# EAGLE design STM32F030F4P6 (EAGLE 9.4.2)
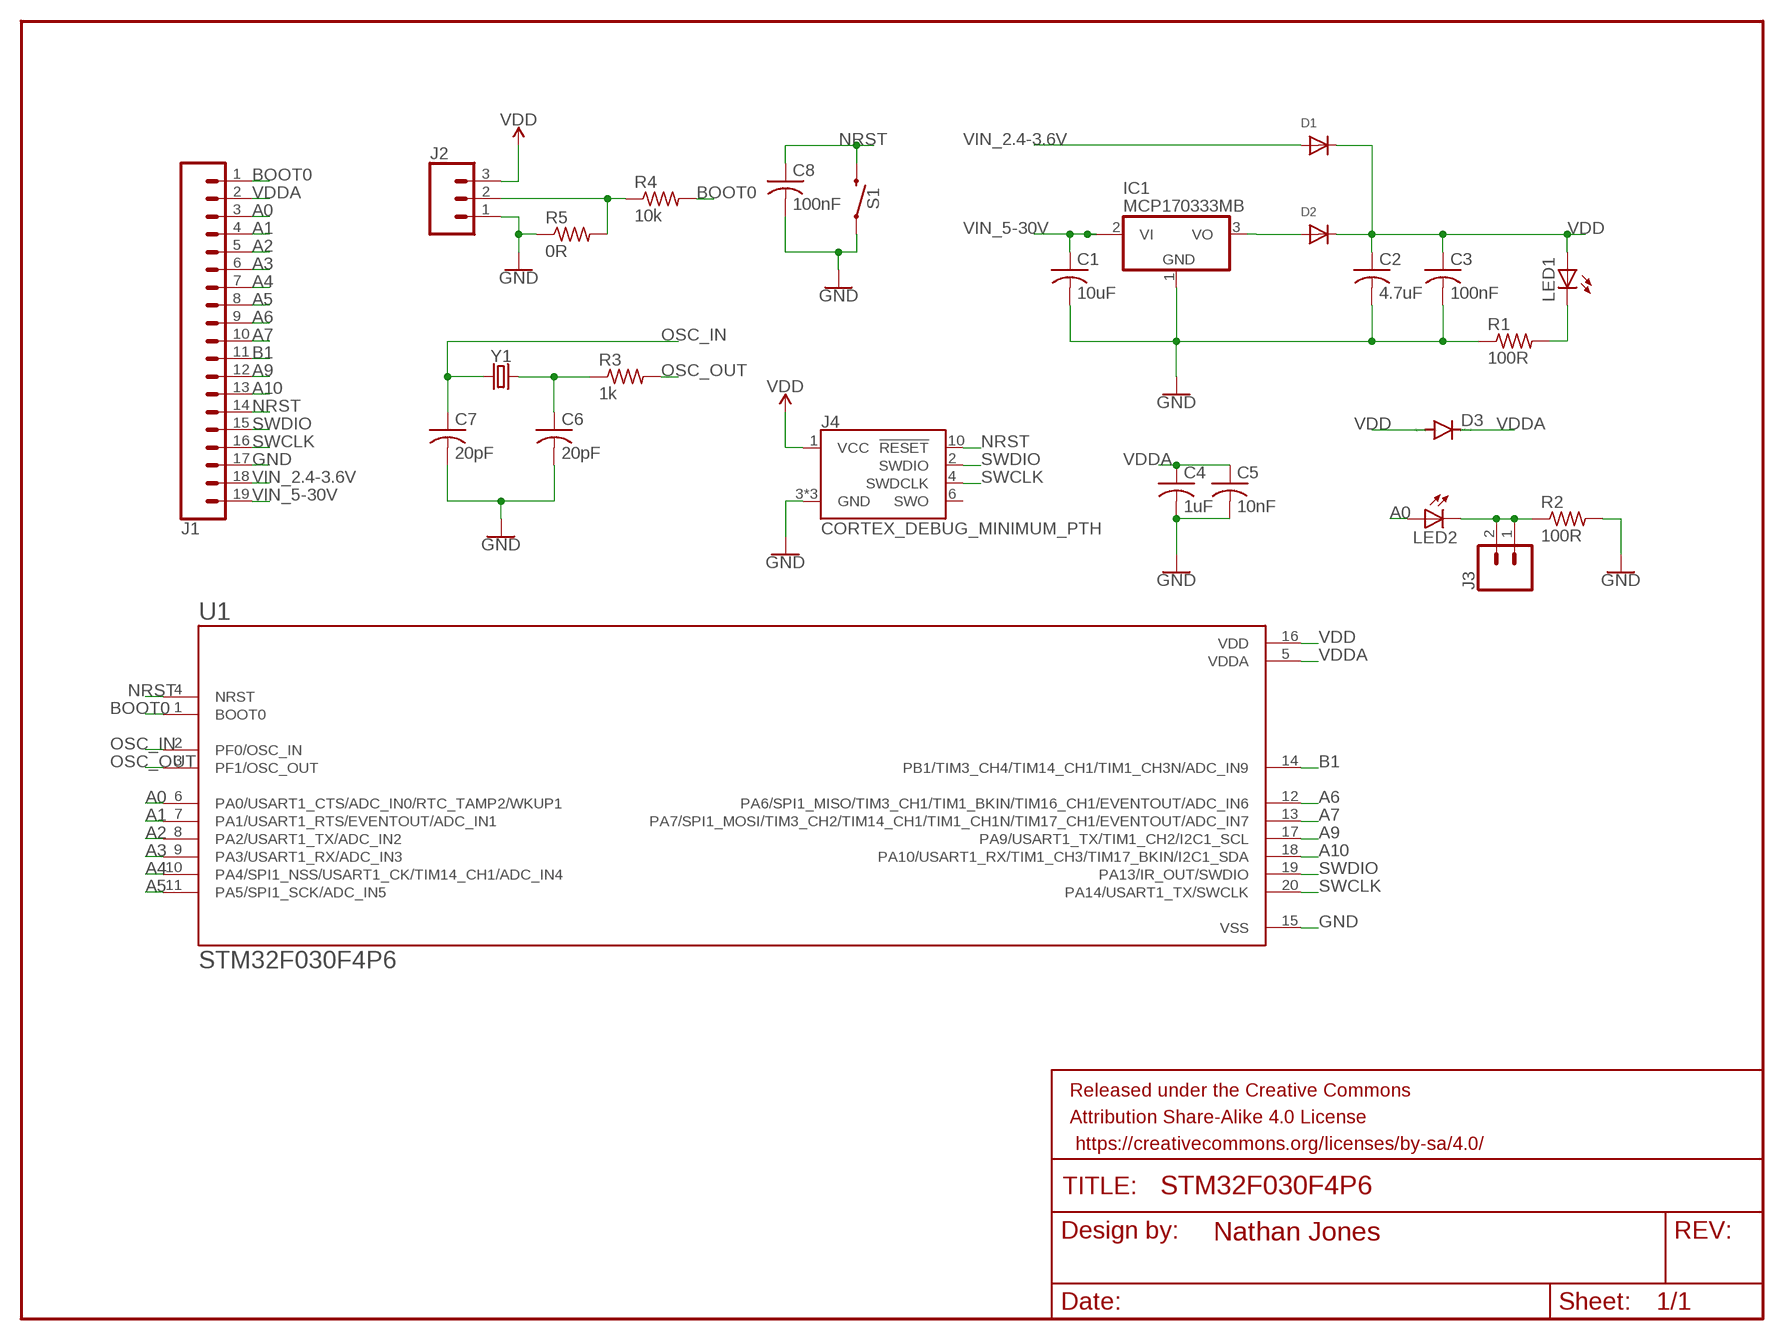
[diagram p0: schematic, sheet 1]

## Parts
C1  10uF  C-USC0603  [C0603]
C2  4.7uF  C-USC0603  [C0603]
C3  100nF  C-USC0603  [C0603]
C4  1uF  C-USC0603  [C0603]
C5  10nF  C-USC0603  [C0603]
C6  20pF  C-USC0603  [C0603]
C7  20pF  C-USC0603  [C0603]
C8  100nF  C-USC0603  [C0603]
D1  DIODESOD-123  [SOD-123]
D2  DIODESOD-123  [SOD-123]
D3  DIODE-DO-214AC  [DO-214AC]
FRAME2  FRAME-LETTERNO_PACKAGE  [DUMMY]
IC1  MCP170333MB  [SOT89]
J1  CONN_19  [1X19]
J2  455-1750-1-ND  CONN_03  [1X03]
J3  CONN_02  [1X02]
J4  CORTEX_DEBUG_MINIMUM_PTH  [2X5-PTH-1.27MM]
LED1  LEDCHIPLED_0603  [CHIPLED_0603]
LED2  LEDCHIPLED_0603  [CHIPLED_0603]
R1  100R  R-US_R0603  [R0603]
R2  100R  R-US_R0603  [R0603]
R3  1k  R-US_R0603  [R0603]
R4  10k  R-US_R0603  [R0603]
R5  0R  R-US_R0603  [R0603]
S1  MOMENTARY-SWITCH-SPST-SMD-5.2-REDUNDANT  [TACTILE_SWITCH_SMD_5.2MM]
U1  STM32F030F4P6  [SOP65P640X120-20N]
Y1  CRYSTALSMD-5X3.2-2PAD  [CRYSTAL-SMD-5X3.2-2PAD]

## Nets
A0: J1.3 LED2.A U1.6(PA0/USART1_CTS/ADC_IN0/RTC_TAMP2/WKUP1)
A1: J1.4 U1.7(PA1/USART1_RTS/EVENTOUT/ADC_IN1)
A2: J1.5 U1.8(PA2/USART1_TX/ADC_IN2)
A3: J1.6 U1.9(PA3/USART1_RX/ADC_IN3)
A4: J1.7 U1.10(PA4/SPI1_NSS/USART1_CK/TIM14_CH1/ADC_IN4)
A5: J1.8 U1.11(PA5/SPI1_SCK/ADC_IN5)
A6: J1.9 U1.12(PA6/SPI1_MISO/TIM3_CH1/TIM1_BKIN/TIM16_CH1/EVENTOUT/ADC_IN6)
A7: J1.10 U1.13(PA7/SPI1_MOSI/TIM3_CH2/TIM14_CH1/TIM1_CH1N/TIM17_CH1/EVENTOUT/ADC_IN7)
A9: J1.12 U1.17(PA9/USART1_TX/TIM1_CH2/I2C1_SCL)
A10: J1.13 U1.18(PA10/USART1_RX/TIM1_CH3/TIM17_BKIN/I2C1_SDA)
B1: J1.11 U1.14(PB1/TIM3_CH4/TIM14_CH1/TIM1_CH3N/ADC_IN9)
BOOT0: J1.1 R4.2 U1.1(BOOT0)
GND: C1.2 C2.2 C3.2 C4.2 C5.2 C6.2 C7.2 C8.2 IC1.1(GND) J1.17 J2.1 J4.3(GND) J4.5(GND) J4.9(GND) R1.1 R2.2 R5.1 S1.1 S1.2 U1.15(VSS)
N$1: J2.2 R4.1 R5.2
N$2: J3.1 J3.2 LED2.C R2.1
N$3: C6.1 R3.1 Y1.P$1
N$5: D2.A IC1.3(VO)
N$7: LED1.C R1.2
NRST: C8.1 J1.14 J4.10(!RESET) S1.3 S1.4 U1.4(NRST)
OSC_IN: C7.1 U1.2(PF0/OSC_IN) Y1.P$2
OSC_OUT: R3.2 U1.3(PF1/OSC_OUT)
SWCLK: J1.16 J4.4(SWDCLK) U1.20(PA14/USART1_TX/SWCLK)
SWDIO: J1.15 J4.2(SWDIO) U1.19(PA13/IR_OUT/SWDIO)
VDD: C2.1 C3.1 D1.C D2.C D3.A J2.3 J4.1(VCC) LED1.A U1.16(VDD)
VDDA: C4.1 C5.1 D3.C J1.2 U1.5(VDDA)
VIN_2.4-3.6V: D1.A J1.18
VIN_5-30V: C1.1 IC1.2@1(VI1) J1.19
Unconnected: IC1.2(VI) J4.6(SWO)

## Library data of the parts
C1-C8 = adafruit:C-US: CAPACITOR, American symbol
D1 D2 = adafruit:DIODE: Diode SMADIODE - SMA Surface Mount Package 20V 1A Schottky Diode Digikey: 641-1014-6-ND DO-1N4148 - Through Hole Small Current Diode SOD-123 20V 1 A (.5mV Vf) Schottky Diode - Digikey: MBRX120TPMSCT-ND SOD-323 10V 570mA (.38mV Vf, 3ns) Schottky Diode - Digikey: ZLLS410CT-ND SOD-523 30V 30mA Schottky Diode (RB751S-40TE61) - Digikey: RB751S-40TE61CT-ND SOT23-R/W - SOT23 Package (R = Solder Paste/Reflow Ovens, W = Hand-Soldering) BAT54Film 40V 300mA - Digikey: 497-7162-1-ND
D3 = diode:DIODE-: DIODE
FRAME2 = SparkFun-Aesthetics:FRAME-LETTER: Schematic Frame - Letter Standard 8.5x11 US Letter frame; DESIGNER: Nathan Jones; VERSION: v01
IC1 = linear:MCP1703*: 250 mA, 16V, Low Quiescent Current LDO Regulator Source: http://ww1.microchip.com/downloads/en/DeviceDoc/22049b.pdf
J1 = SparkFun-Connectors:CONN_19: Multi connection point. Often used as Generic Header-pin footprint for 0.1 inch spaced/style header connections On any of the 0.1 inch spaced packages, you can populate with these: Break Away Headers - Straight <https://www.sparkfun.com/products/116> (PRT-00116) Break Away Male Headers - Right Angle <https://www.sparkfun.com/products/553> (PRT-00553) Female Headers <https://www.sparkfun.com/products/115> (PRT-00115) Break Away Headers - Machine Pin <https://www.sparkfun.com/products/117> (PRT-00117) Break Away Female Headers - Swiss Machine Pin <https://www.sparkfun.com/products/743> (PRT-00743) For SCREWTERMINALS and SPRING TERMINALS visit here: Screw Terimnals on SparkFun.com <https://www.sparkfun.com/search/results?term=Screw+Terminals> (5mm/3.5mm/2.54mm spacing) This device is also useful as a general connection point to wire up your design to another part of your project. Our various solder wires solder well into these plated through hole pads. Hook-Up Wire - Assortment (Stranded, 22 AWG) <https://www.sparkfun.com/products/11375> (PRT-11375) Hook-Up Wire - Assortment (Solid Core, 22 AWG) <https://www.sparkfun.com/products/11367> (PRT-11367) View the entire wire category on our website here <https://www.sparkfun.com/categories/141> Special notes: Molex polarized connector foot print use with SKU : PRT-08231 with associated crimp pins and housings. 1MM SMD Version SKU: PRT-10208 NOTES ON THE VARIANTS LOCK and LOCK_LONGPADS... This footprint was designed to help hold the alignment of a through-hole component (i.e. 6-pin header) while soldering it into place. You may notice that each hole has been shifted either up or down by 0.005 of an inch from it's more standard position (which is a perfectly straight line). This slight alteration caused the pins (the squares in the middle) to touch the edges of the holes. Because they are alternating, it causes a "brace" to hold the component in place. 0.005 has proven to be the perfect amount of "off-center" position when using our standard breakaway headers. Although looks a little odd when you look at the bare footprint, once you have a header in there, the alteration is very hard to notice. Also,if you push a header all the way into place, it is covered up entirely on the bottom side.
J2 = SparkFun-Connectors:CONN_03: Multi connection point. Often used as Generic Header-pin footprint for 0.1 inch spaced/style header connections On any of the 0.1 inch spaced packages, you can populate with these: Break Away Headers - Straight <https://www.sparkfun.com/products/116> (PRT-00116) Break Away Male Headers - Right Angle <https://www.sparkfun.com/products/553> (PRT-00553) Female Headers <https://www.sparkfun.com/products/115> (PRT-00115) Break Away Headers - Machine Pin <https://www.sparkfun.com/products/117> (PRT-00117) Break Away Female Headers - Swiss Machine Pin <https://www.sparkfun.com/products/743> (PRT-00743) Stackable Header - 3 Pin (Female, 0.1") <https://www.sparkfun.com/products/13875> (PRT-13875) For SCREWTERMINALS and SPRING TERMINALS visit here: Screw Terimnals on SparkFun.com <https://www.sparkfun.com/search/results?term=Screw+Terminals> (5mm/3.5mm/2.54mm spacing) This device is also useful as a general connection point to wire up your design to another part of your project. Our various solder wires solder well into these plated through hole pads. Hook-Up Wire - Assortment (Stranded, 22 AWG) <https://www.sparkfun.com/products/11375> (PRT-11375) Hook-Up Wire - Assortment (Solid Core, 22 AWG) <https://www.sparkfun.com/products/11367> (PRT-11367) View the entire wire category on our website here <https://www.sparkfun.com/categories/141> Special notes: Molex polarized connector foot print use with SKU : PRT-08232 with associated crimp pins and housings.; PROD_ID: XXX-00000
J3 = SparkFun-Connectors:CONN_02: Multi connection point. Often used as Generic Header-pin footprint for 0.1 inch spaced/style header connections On any of the 0.1 inch spaced packages, you can populate with these: Break Away Headers - Straight <https://www.sparkfun.com/products/116> (PRT-00116) Break Away Male Headers - Right Angle <https://www.sparkfun.com/products/553> (PRT-00553) Female Headers <https://www.sparkfun.com/products/115> (PRT-00115) Break Away Headers - Machine Pin <https://www.sparkfun.com/products/117> (PRT-00117) Break Away Female Headers - Swiss Machine Pin <https://www.sparkfun.com/products/743> (PRT-00743) For SCREWTERMINALS and SPRING TERMINALS visit here: Screw Terimnals on SparkFun.com <https://www.sparkfun.com/search/results?term=Screw+Terminals> (5mm/3.5mm/2.54mm spacing) This device is also useful as a general connection point to wire up your design to another part of your project. Our various solder wires solder well into these plated through hole pads. Hook-Up Wire - Assortment (Stranded, 22 AWG) <https://www.sparkfun.com/products/11375> (PRT-11375) Hook-Up Wire - Assortment (Solid Core, 22 AWG) <https://www.sparkfun.com/products/11367> (PRT-11367) View the entire wire category on our website here <https://www.sparkfun.com/categories/141> Special notes: Molex polarized connector foot print use with: PRT-08233 with associated crimp pins and housings. 2.54_SCREWTERM for use with PRT-10571. 3.5mm Screw Terminal footprints for PRT-08084 5mm Screw Terminal footprints for use with PRT-08432
J4 = SparkFun-Connectors:CORTEX_DEBUG_MINIMUM: Cortex Debug Connector - 10 pin Supports JTAG debug, Serial Wire debug, and Serial Wire Viewer. PTH and SMD connector options available. General Connector Information <http://infocenter.arm.com/help/topic/com.arm.doc.faqs/attached/13634/cortex_debug_connectors.pdf> Products: PTH Connector <http://www.digikey.com/product-detail/en/cnc-tech/3220-10-0100-00/1175-1627-ND/3883661> -via Digi-Key SparkFun PSoc <https://www.sparkfun.com/products/13229> SparkFun T <https://www.sparkfun.com/products/13810>
LED1 LED2 = adafruit:LED: LED OSRAM: - CHIPLED LG R971, LG N971, LY N971, LG Q971, LY Q971, LO R971, LY R971 LH N974, LH R974 LS Q976, LO Q976, LY Q976 LO Q996 - Hyper CHIPLED LW Q18S LB Q993, LB Q99A, LB R99A - SideLED LS A670, LO A670, LY A670, LG A670, LP A670 LB A673, LV A673, LT A673, LW A673 LH A674 LY A675 LS A676, LA A676, LO A676, LY A676, LW A676 LS A679, LY A679, LG A679 - Hyper Micro SIDELED® LS Y876, LA Y876, LO Y876, LY Y876 LT Y87S - SmartLED LW L88C, LW L88S LB L89C, LB L89S, LG L890 LS L89K, LO L89K, LY L89K LS L896, LA L896, LO L896, LY L896 - TOPLED LS T670, LO T670, LY T670, LG T670, LP T670 LSG T670, LSP T670, LSY T670, LOP T670, LYG T670 LG T671, LOG T671, LSG T671 LB T673, LV T673, LT T673, LW T673 LH T674 LS T676, LA T676, LO T676, LY T676, LB T676, LH T676, LSB T676, LW T676 LB T67C, LV T67C, LT T67C, LS T67K, LO T67K, LY T67K, LW E67C LS E67B, LA E67B, LO E67B, LY E67B, LB E67C, LV E67C, LT E67C LW T67C LS T679, LY T679, LG T679 LS T770, LO T770, LY T770, LG T770, LP T770 LB T773, LV T773, LT T773, LW T773 LH T774 LS E675, LA E675, LY E675, LS T675 LS T776, LA T776, LO T776, LY T776, LB T776 LHGB T686 LT T68C, LB T68C - Hyper Mini TOPLED® LB M676 - Mini TOPLED Santana® LG M470 LS M47K, LO M47K, LY M47K Source: http://www.osram.convergy.de/
R1-R5 = adafruit:R-US_: RESISTOR, American symbol
S1 = SparkFun-Switches:MOMENTARY-SWITCH-SPST: Momentary Switch (Pushbutton) - SPST Normally-open (NO) SPST momentary switches (buttons, pushbuttons). Variants PTH-12MM - 12mm square, through-hole Momentary Pushbutton Switch - 12mm Square <https://www.sparkfun.com/products/9190> (COM-09190) PTH-6.0MM, PTH-6.0MM-KIT - 6.0mm square, through-hole Mini Pushbutton Switch <https://www.sparkfun.com/products/97> (COM-00097) KIT package intended for soldering kit's - only one side of pads' copper is exposed. PTH-RIGHT-ANGLE-KIT - Right-angle, through-hole Right Angle Tactile Button <https://www.sparkfun.com/products/10791> - Used on SparkFun BigTime Watch Kit <https://www.sparkfun.com/products/11734> SMD-12MM - 12mm square, surface-mount Tactile Button - SMD (12mm) <https://www.sparkfun.com/products/12993> (COM-12993) Used on SparkFun PicoBoard <https://www.sparkfun.com/products/11888> SMD-4.5MM - 4.5mm Square Trackball Switch Used on SparkFun Blackberry Trackballer Breakout <https://www.sparkfun.com/products/13169> SMD-4.6MMX2.8MM - 4.60mm x 2.80mm, surface mount Used on SparkFun SAMD21 Mini Breakout <https://www.sparkfun.com/products/13664> SMD-5.2MM, SMD-5.2-REDUNDANT - 5.2mm square, surface-mount Mini Pushbutton Switch - SMD <https://www.sparkfun.com/products/8720> (COM-08720) Used on Arduino Pro Mini <https://www.sparkfun.com/products/11114> REDUNDANT package connects both switch circuits together SMD-6.0X3.5MM - 6.0 x 3.5mm, surface mount Momentary Reset Switch SMD <https://www.sparkfun.com/products/8229> (COM-08229) SMD-6.2MM-TALL - 6.2mm square, surface mount Tactile Button - SMD (6mm) <https://www.sparkfun.com/products/12992> Used on SparkFun Digital Sandbox <https://www.sparkfun.com/products/12651> SMD-RIGHT-ANGLE - Right-angle, surface mount Used on SparkFun Block for Intel® Edison - Arduino <https://www.sparkfun.com/products/13036>; PROD_ID: SWCH-08247; SF_SKU: COM-08720
U1 = STM32F030F4P6:STM32F030F4P6: MCU 32-bit STM32F ARM Cortex M0 RISC 16KB Flash 2.5V/3.3V 20-Pin TSSOP Tray; DESCRIPTION: ARM® Cortex®-M0 STM32F0 Microcontroller IC 32-Bit 48MHz 16KB _16K x 8_ FLASH; DIGI-KEY_PART_NUMBER: 497-14044-5-ND; DIGI-KEY_PURCHASE_URL: https://www.digikey.com/product-detail/en/stmicroelectronics/STM32F030F4P6/497-14044-5-ND/4357517?utm_source=snapeda&utm_medium=aggregator&utm_campaign=symbol; MF: STMicroelectronics; MP: STM32F030F4P6; PACKAGE: TSSOP-20 STMicroelectronics
Y1 = SparkFun-Clocks:CRYSTAL: Crystals (Generic) These are passive quartz crystals, which can be used as a clock source for a microcontroller. Crystal's are two-terminal devices. They require external "load" capacitors to generate an oscillating signal.

## Board
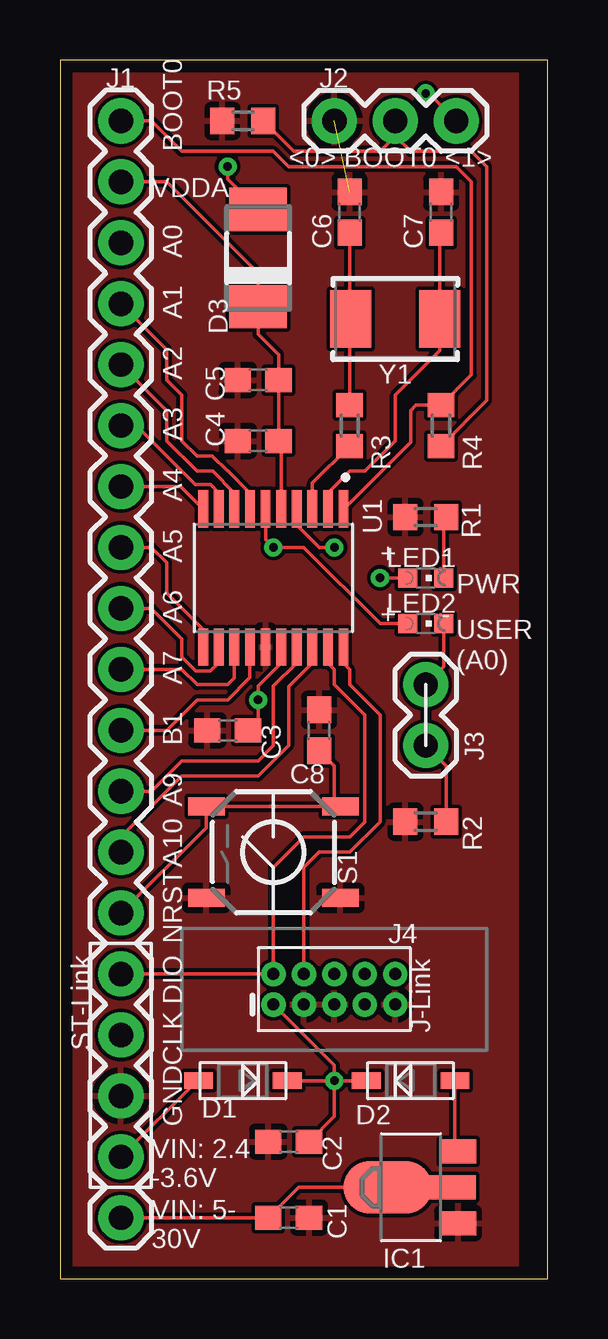
[diagram p1: board, top side]
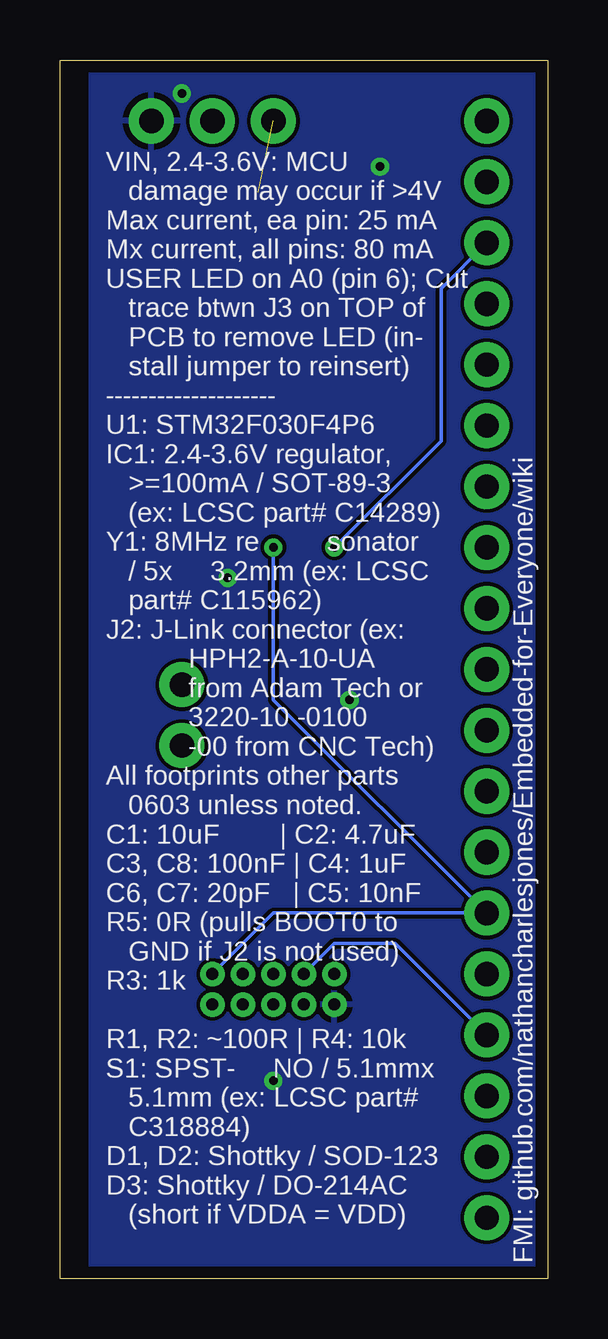
[diagram p2: board, bottom side, seen from below]

Size 20.32 x 50.8 mm. Coordinates in mm from the lower left corner, seen from the top.
Outline: 0,0 20.32,0 20.32,50.8 0,50.8 0,0
Copper layers (1*16): Top 0.035mm / dielectric 1.5mm / Bottom 0.035mm
Design rules "default *": minimum track width 6mil, minimum drill 0.35mm, track to track 6mil, track to pad 6mil, pad to pad 6mil, via to via 6mil, smd to smd 6mil, copper to edge 20mil, drill to drill 6mil, minimum pad ring 10mil, minimum via ring 8mil, stop-mask expansion 4mil, vias tented up to drill 0mil, thermal gap 10mil

### Footprints (pad centres in the part's own frame; a part is rotated, then mirrored left to right if it is on the bottom)
C0603 = smd 1.1 x 1: 1 -0.85,0; 2 0.85,0
SOD-123 = smd 1.2 x 0.7: A 1.85,0; C -1.85,0
DO-214AC = smd 1.8 x 2.4: A 2.025,0; C -2.025,0
SOT89 = smd 1 x 1.5: 1 -1.499,-1.981; 3 1.499,-1.981 | smd 1 x 2: 2 0,-1.727 | smd 2.2 x 3.7: 2@1 0,0.94
1X19 = drill 1.016 pad 1.88: 1 0,0; 2 2.54,0; 3 5.08,0; 4 7.62,0; 5 10.16,0; 6 12.7,0; 7 15.24,0; 8 17.78,0; 9 20.32,0; 10 22.86,0; 11 25.4,0; 12 27.94,0; 13 30.48,0; 14 33.02,0; 15 35.56,0; 16 38.1,0; 17 40.64,0; 18 43.18,0; 19 45.72,0
1X03 = drill 1.016 pad 1.88: 1 0,0; 2 2.54,0; 3 5.08,0
1X02 = drill 1.016 pad 1.88: 1 0,0; 2 2.54,0
2X5-PTH-1.27MM = drill 0.508 pad 1: 1 -2.54,-0.635; 2 -2.54,0.635; 3 -1.27,-0.635; 4 -1.27,0.635; 5 0,-0.635; 6 0,0.635; 7 1.27,-0.635; 8 1.27,0.635; 9 2.54,-0.635; 10 2.54,0.635
CHIPLED_0603 = smd 0.8 x 0.8: A 0,-0.75; C 0,0.75
R0603 = smd 1 x 1.1: 1 -0.85,0; 2 0.85,0
TACTILE_SWITCH_SMD_5.2MM = smd 1.524 x 0.762: 1 -2.794,1.905; 2 2.794,1.905; 3 -2.794,-1.905; 4 2.794,-1.905
SOP65P640X120-20N = smd 1.56 x 0.41: 1 -2.88,2.925; 2 -2.88,2.275; 3 -2.88,1.625; 4 -2.88,0.975; 5 -2.88,0.325; 6 -2.88,-0.325; 7 -2.88,-0.975; 8 -2.88,-1.625; 9 -2.88,-2.275; 10 -2.88,-2.925; 11 2.88,-2.925; 12 2.88,-2.275; 13 2.88,-1.625; 14 2.88,-0.975; 15 2.88,-0.325; 16 2.88,0.325; 17 2.88,0.975; 18 2.88,1.625; 19 2.88,2.275; 20 2.88,2.925
CRYSTAL-SMD-5X3.2-2PAD = smd 1.7 x 2.4: P$1 1.85,0; P$2 -1.85,0

### Placement (x,y rotation side)
C1  9.53,2.54 0 top
C2  9.53,5.71 180 top
C3  6.99,22.86 180 top
C4  8.26,34.92 180 top
C5  8.26,37.47 180 top
C6  12.06,44.45 90 top
C7  15.88,44.45 90 top
C8  10.79,22.86 90 top
D1  7.62,8.26 180 top
D2  14.61,8.26 0 top
D3  8.26,42.55 90 top
FRAME2  -10.79,0 0 top  (outside the outline)
IC1  14.61,3.81 90 top
J1  2.54,48.26 270 top
J2  11.43,48.26 0 top
J3  15.24,22.23 90 top
J4  11.43,12.06 0 top
LED1  15.24,29.21 270 top
LED2  15.24,27.3 270 top
R1  15.24,31.75 0 top
R2  15.24,19.05 180 top
R3  12.06,35.56 270 top
R4  15.88,35.56 90 top
R5  7.62,48.26 0 top
S1  8.89,17.78 180 top
U1  8.89,29.21 270 top
Y1  13.97,40.01 180 top

### Tracks (layer width: path | path; a pad name or v marks a point on that pad's centre or on a via)
A0  (via drill 0.35)
  Top 0.152: U1.6 8.56,30.8 v8.89,30.48 10.16,30.48 13.34,27.3 LED2.A
  Bottom 0.152: v8.89,30.48 4.45,34.92 4.45,41.27 J1.3
A1
  Top 0.152: U1.7 7.92,32.75 7.01,33.66 6.99,33.66 6.35,34.29 5.71,34.29 5.08,34.92 5.08,36.83 4.45,37.47 4.45,38.73 J1.4
A2
  Top 0.152: U1.8 7.26,32.75 6.36,33.66 5.71,33.66 4.45,34.92 4.45,36.2 J1.5
A3
  Top 0.152: U1.9 6.62,32.76 6.27,33.1 5.64,33.1 3.17,35.56 J1.6
A4
  Top 0.152: U1.10 5.04,33.02 J1.7
A5
  Top 0.152: U1.11 5.96,27.05 4.45,28.57 4.45,29.84 3.81,30.48 J1.8
A6
  Top 0.152: U1.12 6.62,25.67 6.26,25.32 5.67,25.32 5.08,25.91 5.08,26.67 3.81,27.94 J1.9
A7
  Top 0.152: U1.13 7.26,25.05 6.99,24.77 5.71,24.77 5.08,25.4 J1.10
A9
  Top 0.152: U1.17 9.87,25.67 8.89,24.7 8.89,22.23 8.26,21.59 5.08,21.59 3.81,20.32 J1.12
A10
  Top 0.152: U1.18 10.52,25.67 9.53,24.68 9.53,22.23 8.26,20.95 5.08,20.95 2.54,18.41 J1.13
B1
  Top 0.152: U1.14 7.92,25.06 6.99,24.13 5.71,24.13 4.45,22.86 J1.11
BOOT0
  Top 0.152: U1.1 14.61,34.88 14.61,36.2 14.82,36.41 R4.2 17.14,37.68 17.14,45.72 16.51,46.35 9.53,46.35 8.89,46.99 5.08,46.99 3.81,48.26 J1.1
GND  (1 unrouted)
  pour Top: 0,50.8 19.05,50.8 19.05,0 0,0
N$1
  Top 0.152: R4.1 17.78,36.62 17.78,46.35 17.14,46.99 14.61,46.99 13.97,47.62 | J2.2 13.97,47.62 | 13.97,47.62 13.34,46.99 9.74,46.99 R5.2
N$2
  Top 0.152: LED2.C 15.99,25.52 J3.2 J3.1 16.09,21.38 R2.1
N$3
  Top 0.152: R3.1 12.06,39.95 Y1.P$1 12.06,40.06 C6.1
N$5
  Top 0.152: IC1.3 16.45,5.44 D2.A
N$7
  Top 0.152: LED1.C 15.99,31.65 R1.2
NRST  (via drill 0.35)
  Top 0.152: J1.14 6.1,18.8 S1.4 11.43,19.68 | 11.43,19.68 S1.3 | C8.1 11.43,21.38 11.43,19.68 | U1.4 9.87,31.41 10.79,30.48 v11.43,30.48
  Bottom 0.152: J4.10 11.43,15.24 8.89,15.24 J1.14 11.43,24.13 v11.43,30.48
OSC_IN
  Top 0.152: U1.2 11.16,32.76 12.06,33.66 12.7,33.66 13.97,34.92 13.97,36.83 15.82,38.68 Y1.P$2 15.82,43.55 C7.1
OSC_OUT
  Top 0.152: U1.3 10.52,33.16 R3.2
SWCLK
  Top 0.152: U1.20 11.81,25.65 12.06,25.4 12.06,24.77 13.34,23.5 13.34,19.05 12.06,17.78 10.79,17.78 10.16,17.14 J4.4
  Bottom 0.152: J1.16 6.35,13.97 8.89,13.97 J4.4
SWDIO
  Top 0.152: U1.19 11.16,25.66 11.43,25.4 11.43,24.77 12.7,23.5 12.7,19.05 12.06,18.41 10.16,18.41 8.89,17.14 J4.2 J1.15
VDD  (via drill 0.35)
  Top 0.152: D3.A 6.99,45.84 v6.99,46.35 | J2.3 15.36,49.41 v15.24,49.41 | U1.16 9.21,25.67 8.26,24.71 v8.26,24.13 8.26,23.28 C3.1 | LED1.A v13.34,29.21 | J4.1 11.43,8.89 v11.43,8.26 | D1.C v11.43,8.26 | v11.43,8.26 D2.C | C2.1 11.43,6.77 v11.43,8.26
  pour Bottom: 0,50.8 19.05,50.8 19.05,0 0,0
VDDA
  Top 0.152: U1.5 9.21,34.81 C4.1 C5.1 9.11,38.52 8.26,39.37 D3.C 8.26,41.91 4.45,45.72 J1.2
VIN_2.4-3.6V
  Top 0.152: J1.18 5.71,8.26 D1.A
VIN_5-30V
  Top 0.152: J1.19 C1.1 9.95,3.81 IC1.2@1

### Text on the board
tPlace: J-Link | ST-Link
tNames: BOOT0 | <0> BOOT0 <1> | VDDA | A0 | A1 | A2 | A3 | A4 | A5 | + - | PWR | A6 | + - | USER | A7 | (A0) | B1 | A9 | A10 | NRST | DIO | CLK | GND | VIN: 2.4 / -3.6V | VIN: 5- / 30V
bNames: VIN, 2.4-3.6V: MCU / damage may occur if >4V / Max current, ea pin: 25 mA / Mx current, all pins: 80 mA / USER LED on A0 (pin 6); Cut / trace btwn J3 on TOP of / PCB to remove LED (in- / stall jumper to reinsert) / -------------------- / U1: STM32F030F4P6 / IC1: 2.4-3.6V regulator, / >=100mA / SOT-89-3 / (ex: LCSC part# C14289) / Y1: 8MHz re sonator / / 5x 3.2mm (ex: LCSC / part# C115962) / J2: J-Link connector (ex: / HPH2-A-10-UA / from Adam Tech or / 3220-10 -0100 / -00 from CNC Tech) / All footprints other parts / 0603 unless noted. / C1: 10uF | C2: 4.7uF / C3, C8: 100nF | C4: 1uF / C6, C7: 20pF | C5: 10nF / R5: 0R (pulls BOOT0 to / GND if J2 is not used) / R3: 1k / / R1, R2: ~100R | R4: 10k / S1: SPST- NO / 5.1mmx / 5.1mm (ex: LCSC part# / C318884) / D1, D2: Shottky / SOD-123 / D3: Shottky / DO-214AC / (short if VDDA = VDD) | FMI: github.com/nathancharlesjones/Embedded-for-Everyone/wiki